# Altium schematic sheet Keys.SchDoc
size A4; SheetNumber: 3; SheetTotal: 3
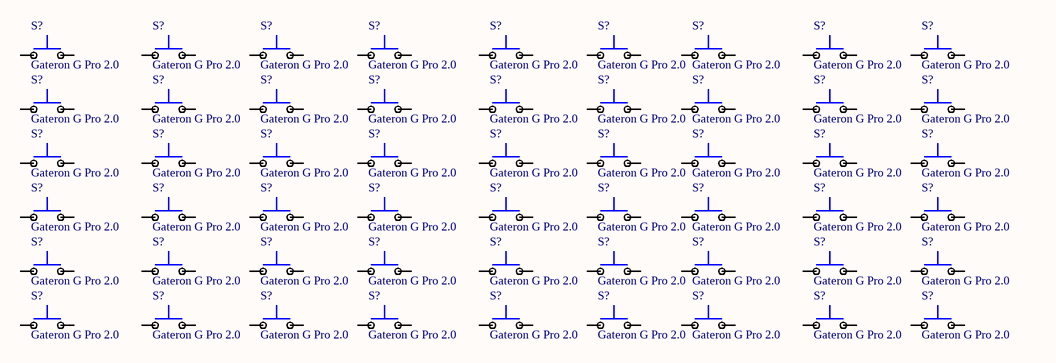
[diagram p0: Keys.SchDoc]

## Parts
(Parts that share a designator on the sheet are numbered #1, #2 ... from top to bottom, then left to right.)
S?#1  Gateron G Pro 2.0  [Mechanical Switch]
S?#2  Gateron G Pro 2.0  [Mechanical Switch]
S?#3  Gateron G Pro 2.0  [Mechanical Switch]
S?#4  Gateron G Pro 2.0  [Mechanical Switch]
S?#5  Gateron G Pro 2.0  [Mechanical Switch]
S?#6  Gateron G Pro 2.0  [Mechanical Switch]
S?#7  Gateron G Pro 2.0  [Mechanical Switch]
S?#8  Gateron G Pro 2.0  [Mechanical Switch]
S?#9  Gateron G Pro 2.0  [Mechanical Switch]
S?#10  Gateron G Pro 2.0  [Mechanical Switch]
S?#11  Gateron G Pro 2.0  [Mechanical Switch]
S?#12  Gateron G Pro 2.0  [Mechanical Switch]
S?#13  Gateron G Pro 2.0  [Mechanical Switch]
S?#14  Gateron G Pro 2.0  [Mechanical Switch]
S?#15  Gateron G Pro 2.0  [Mechanical Switch]
S?#16  Gateron G Pro 2.0  [Mechanical Switch]
S?#17  Gateron G Pro 2.0  [Mechanical Switch]
S?#18  Gateron G Pro 2.0  [Mechanical Switch]
S?#19  Gateron G Pro 2.0  [Mechanical Switch]
S?#20  Gateron G Pro 2.0  [Mechanical Switch]
S?#21  Gateron G Pro 2.0  [Mechanical Switch]
S?#22  Gateron G Pro 2.0  [Mechanical Switch]
S?#23  Gateron G Pro 2.0  [Mechanical Switch]
S?#24  Gateron G Pro 2.0  [Mechanical Switch]
S?#25  Gateron G Pro 2.0  [Mechanical Switch]
S?#26  Gateron G Pro 2.0  [Mechanical Switch]
S?#27  Gateron G Pro 2.0  [Mechanical Switch]
S?#28  Gateron G Pro 2.0  [Mechanical Switch]
S?#29  Gateron G Pro 2.0  [Mechanical Switch]
S?#30  Gateron G Pro 2.0  [Mechanical Switch]
S?#31  Gateron G Pro 2.0  [Mechanical Switch]
S?#32  Gateron G Pro 2.0  [Mechanical Switch]
S?#33  Gateron G Pro 2.0  [Mechanical Switch]
S?#34  Gateron G Pro 2.0  [Mechanical Switch]
S?#35  Gateron G Pro 2.0  [Mechanical Switch]
S?#36  Gateron G Pro 2.0  [Mechanical Switch]
S?#37  Gateron G Pro 2.0  [Mechanical Switch]
S?#38  Gateron G Pro 2.0  [Mechanical Switch]
S?#39  Gateron G Pro 2.0  [Mechanical Switch]
S?#40  Gateron G Pro 2.0  [Mechanical Switch]
S?#41  Gateron G Pro 2.0  [Mechanical Switch]
S?#42  Gateron G Pro 2.0  [Mechanical Switch]
S?#43  Gateron G Pro 2.0  [Mechanical Switch]
S?#44  Gateron G Pro 2.0  [Mechanical Switch]
S?#45  Gateron G Pro 2.0  [Mechanical Switch]
S?#46  Gateron G Pro 2.0  [Mechanical Switch]
S?#47  Gateron G Pro 2.0  [Mechanical Switch]
S?#48  Gateron G Pro 2.0  [Mechanical Switch]
S?#49  Gateron G Pro 2.0  [Mechanical Switch]
S?#50  Gateron G Pro 2.0  [Mechanical Switch]
S?#51  Gateron G Pro 2.0  [Mechanical Switch]
S?#52  Gateron G Pro 2.0  [Mechanical Switch]
S?#53  Gateron G Pro 2.0  [Mechanical Switch]
S?#54  Gateron G Pro 2.0  [Mechanical Switch]

## Nets

Not connected (* = marked no-connect by the designer): S?#1 0 1; S?#2 0 1; S?#3 0 1; S?#4 0 1; S?#5 0 1; S?#6 0 1; S?#7 0 1; S?#8 0 1; S?#9 0 1; S?#10 0 1; S?#11 0 1; S?#12 0 1; S?#13 0 1; S?#14 0 1; S?#15 0 1; S?#16 0 1; S?#17 0 1; S?#18 0 1; S?#19 0 1; S?#20 0 1; S?#21 0 1; S?#22 0 1; S?#23 0 1; S?#24 0 1; S?#25 0 1; S?#26 0 1; S?#27 0 1; S?#28 0 1; S?#29 0 1; S?#30 0 1; S?#31 0 1; S?#32 0 1; S?#33 0 1; S?#34 0 1; S?#35 0 1; S?#36 0 1; S?#37 0 1; S?#38 0 1; S?#39 0 1; S?#40 0 1; S?#41 0 1; S?#42 0 1; S?#43 0 1; S?#44 0 1; S?#45 0 1; S?#46 0 1; S?#47 0 1; S?#48 0 1; S?#49 0 1; S?#50 0 1; S?#51 0 1; S?#52 0 1; S?#53 0 1; S?#54 0 1

## Library data of the parts
S?#1-S?#54 = Gateron G Pro 2.0: Gateron G Pro 2.0, The 3-Pin switches are compatible with any 3-Pin/5-Pin MX mechanical keyboard